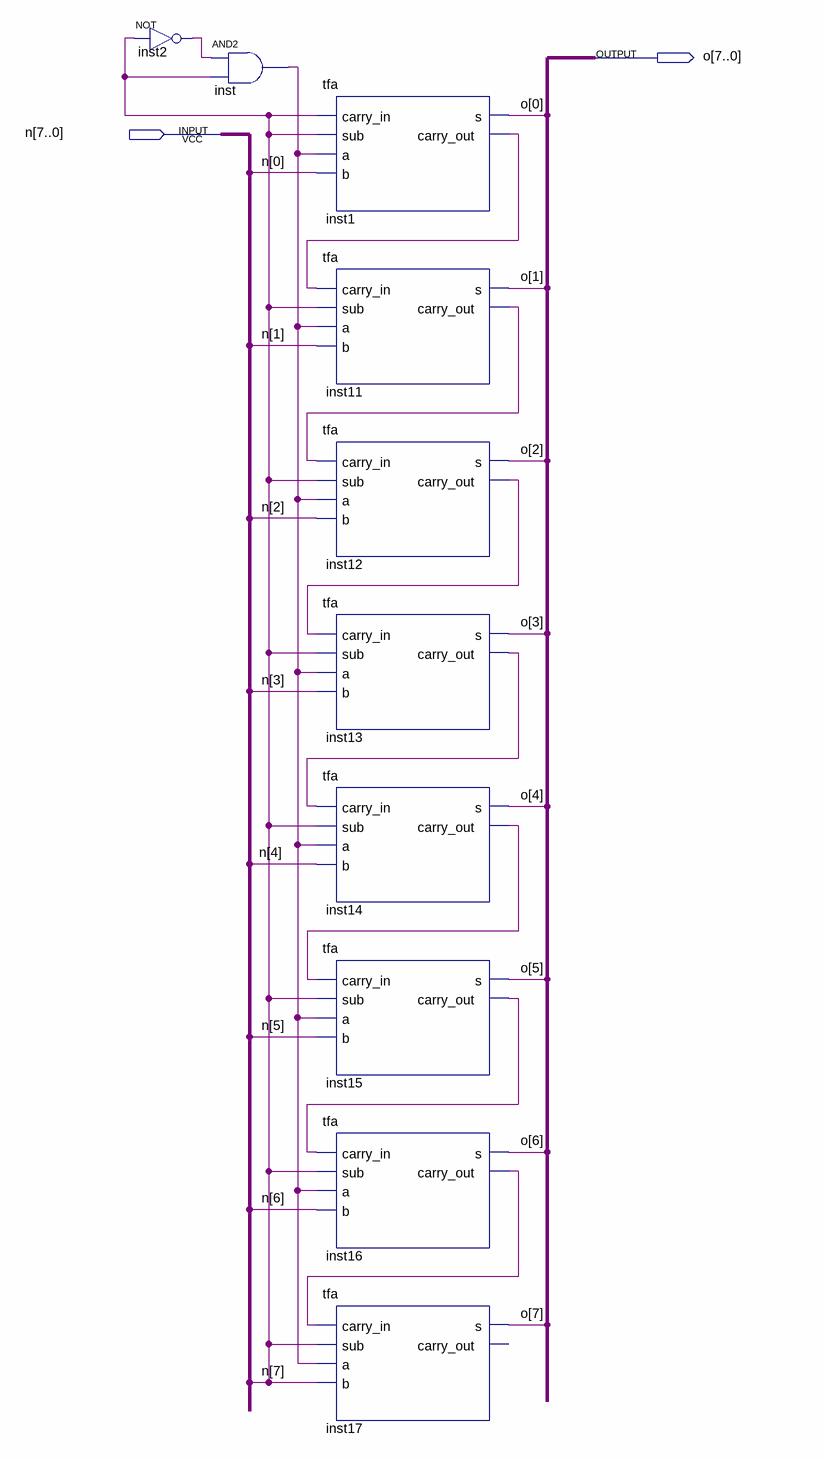
[diagram p0: schematic sheet]
// Quartus schematic jdzx.bdf as structural Verilog: 10 symbols, 2 pins
module jdzx (
  input  [7:0] n,
  output [7:0] o
);

  wire inst1_carry_out, inst2_out, inst11_carry_out, inst12_carry_out, inst13_carry_out, inst14_carry_out,
       inst15_carry_out, inst16_carry_out, inst_out;

  not inst2 (inst2_out, n[7]);
  and inst (inst_out, inst2_out, n[7]);
  tfa inst1 (.carry_in(n[7]), .sub(n[7]), .a(inst_out), .b(n[0]), .s(o[0]), .carry_out(inst1_carry_out));
  tfa inst11 (.carry_in(inst1_carry_out), .sub(n[7]), .a(inst_out), .b(n[1]), .s(o[1]), .carry_out(inst11_carry_out));
  tfa inst12 (.carry_in(inst11_carry_out), .sub(n[7]), .a(inst_out), .b(n[2]), .s(o[2]), .carry_out(inst12_carry_out));
  tfa inst13 (.carry_in(inst12_carry_out), .sub(n[7]), .a(inst_out), .b(n[3]), .s(o[3]), .carry_out(inst13_carry_out));
  tfa inst14 (.carry_in(inst13_carry_out), .sub(n[7]), .a(inst_out), .b(n[4]), .s(o[4]), .carry_out(inst14_carry_out));
  tfa inst15 (.carry_in(inst14_carry_out), .sub(n[7]), .a(inst_out), .b(n[5]), .s(o[5]), .carry_out(inst15_carry_out));
  tfa inst16 (.carry_in(inst15_carry_out), .sub(n[7]), .a(inst_out), .b(n[6]), .s(o[6]), .carry_out(inst16_carry_out));
  tfa inst17 (.carry_in(inst16_carry_out), .sub(n[7]), .a(inst_out), .b(n[7]), .s(o[7]));  // open: carry_out
endmodule
